# Altium schematic sheet mcu.SchDoc
size A3
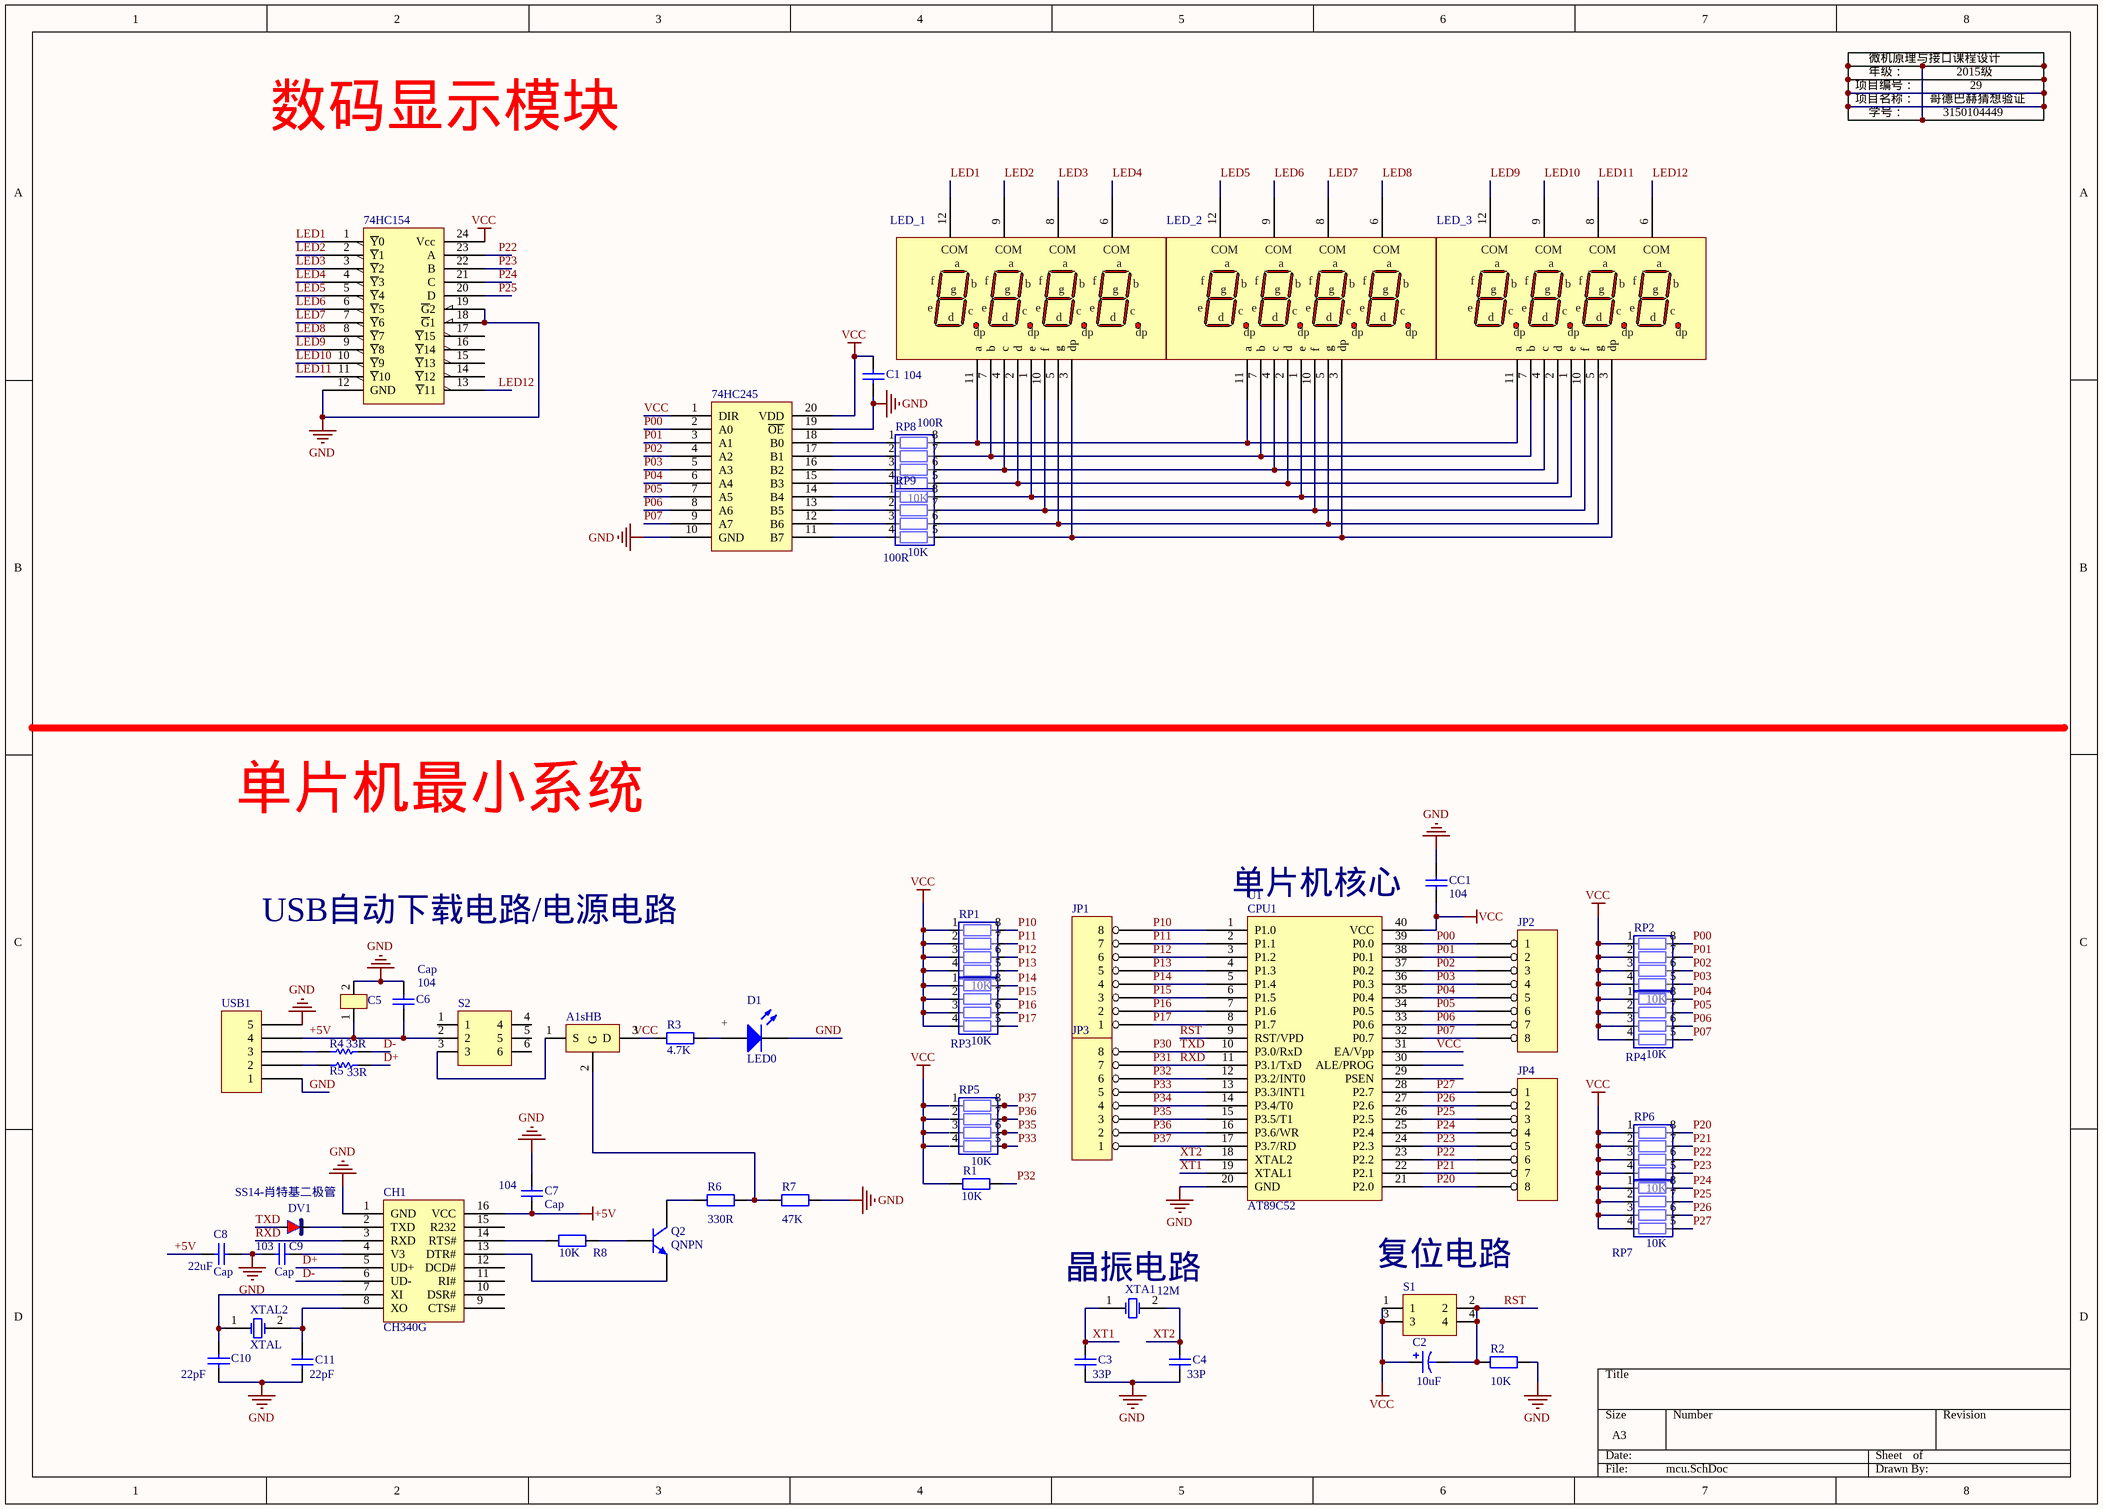
[diagram p0: mcu.SchDoc]

## Parts
74HC154  74HC154  [SOP24-74HC154D]  (value not drawn)
74HC245  74HC245  [SOP20-74HC245]  (value not drawn)
A1sHB  A1sHB  [A1sHB]  (value not drawn)
C1  value 104  [RAD-0.3]  (hidden comment: Cap)
C2  value 10uF  [RB7.6-15]  (hidden comment: Cap Pol1)
C3  value 33P  [RAD-0.3]  (hidden comment: Cap)
C4  value 33P  [RAD-0.3]  (hidden comment: Cap)
C5  470uF  [C5-CP1]  (value not drawn)
C6  Cap  value 104  [RAD-0.3]
C7  Cap  value 104  [RAD-0.3]
C8  Cap  value 22uF  [RAD-0.3]
C9  Cap  value 103  [RAD-0.3]
C10  value 22pF  [RAD-0.3]  (hidden comment: Cap)
C11  value 22pF  [RAD-0.3]  (hidden comment: Cap)
CC1  value 104  [RAD-0.3]  (hidden comment: Cap)
CH1  CH340G  [SOP16-CH1-CH340G]
D1  LED0  [LED-0]
DV1  SS14-肖特基二极管  [DV1-SS14]
JP1  JP1  [JP]  (value not drawn)
JP2  JP1  [JP]  (value not drawn)
JP3  JP1  [JP]  (value not drawn)
JP4  JP1  [JP]  (value not drawn)
LED_1  LED_12  [LED_12]  (value not drawn)
LED_2  LED_12  [LED_12]  (value not drawn)
LED_3  LED_12  [LED_12]  (value not drawn)
Q2  QNPN  [SOT-23B]
R1  value 10K  [AXIAL-0.4]  (hidden comment: Res2)
R2  value 10K  [AXIAL-0.4]  (hidden comment: Res2)
R3  value 4.7K  [AXIAL-0.4]  (hidden comment: Res2)
R4  33R  [AXIAL-0.3]
R5  33R  [AXIAL-0.3]
R6  value 330R  [AXIAL-0.4]  (hidden comment: Res2)
R7  value 47K  [AXIAL-0.4]  (hidden comment: Res2)
R8  value 10K  [AXIAL-0.4]  (hidden comment: Res2)
RP1  RP1  [RP-8P4R-0603]  (value not drawn)
RP2  RP1  [RP-8P4R-0603]  (value not drawn)
RP3  RP1  [RP-8P4R-0603]  (value not drawn)
RP4  RP1  [RP-8P4R-0603]  (value not drawn)
RP5  RP1  [RP-8P4R-0603]  (value not drawn)
RP6  RP1  [RP-8P4R-0603]  (value not drawn)
RP7  RP1  [RP-8P4R-0603]  (value not drawn)
RP8  RP1  [RP-8P4R-0603]  (value not drawn)
RP9  RP1  [RP-8P4R-0603]  (value not drawn)
S1  S1  [DIP4-S1]  (value not drawn)
S2  S2  [DIP6-S2]  (value not drawn)
U1  AT89C52  [CPU_DIP40]
USB1  USB1  [USB1]  (value not drawn)
XTA1  12M  [R38]
XTAL2  XTAL  [R38]

## Nets
+5V: C5.1 C6.1 C7.1 C8.1 CH1.16(VCC) S2.2 USB1.4
GND: 74HC154.12(GND) 74HC154.18(~{G}1) 74HC154.19(~{G}2) 74HC245.10(GND) 74HC245.19(~{OE}) C1.1 C3.1 C4.1 C5.2 C6.2 C7.2 C8.2 C9.1 C10.1 C11.1 CC1.2 CH1.1(GND) D1.2(K) R2.2 R7.2 U1.20(GND) USB1.1 USB1.5
VCC: 74HC154.24(Vcc) 74HC245.1(DIR) 74HC245.20(VDD) C1.2 C2.1 CC1.1 R1.1 RP1.1 RP1.2 RP1.3 RP1.4 RP2.1 RP2.2 RP2.3 RP2.4 RP3.1 RP3.2 RP3.3 RP3.4 RP4.1 RP4.2 RP4.3 RP4.4 RP6.1 RP6.2 RP6.3 RP6.4 RP7.1 RP7.2 RP7.3 RP7.4 S1.1 S1.3 U1.31(EA/Vpp) U1.40(VCC)
D+: CH1.5(UD+) R5.2
D-: CH1.6(UD-) R4.2
LED1: 74HC154.1(~{Y}0) LED_1.12(COM)
LED2: 74HC154.2(~{Y}1) LED_1.9(COM)
LED3: 74HC154.3(~{Y}2) LED_1.8(COM)
LED4: 74HC154.4(~{Y}3) LED_1.6(COM)
LED5: 74HC154.5(~{Y}4) LED_2.12(COM)
LED6: 74HC154.6(~{Y}5) LED_2.9(COM)
LED7: 74HC154.7(~{Y}6) LED_2.8(COM)
LED8: 74HC154.8(~{Y}7) LED_2.6(COM)
LED9: 74HC154.9(~{Y}8) LED_3.12(COM)
LED10: 74HC154.10(~{Y}9) LED_3.9(COM)
LED11: 74HC154.11(~{Y}10) LED_3.8(COM)
LED12: 74HC154.13(~{Y}11) LED_3.6(COM)
P00: 74HC245.2(A0) JP2.1 RP2.8 U1.39(P0.0)
P01: 74HC245.3(A1) JP2.2 RP2.7 U1.38(P0.1)
P02: 74HC245.4(A2) JP2.3 RP2.6 U1.37(P0.2)
P03: 74HC245.5(A3) JP2.4 RP2.5 U1.36(P0.3)
P04: 74HC245.6(A4) JP2.5 RP4.8 U1.35(P0.4)
P05: 74HC245.7(A5) JP2.6 RP4.7 U1.34(P0.5)
P06: 74HC245.8(A6) JP2.7 RP4.6 U1.33(P0.6)
P07: 74HC245.9(A7) JP2.8 RP4.5 U1.32(P0.7)
P10: JP1.8 RP1.8 U1.1(P1.0)
P11: JP1.7 RP1.7 U1.2(P1.1)
P12: JP1.6 RP1.6 U1.3(P1.2)
P13: JP1.5 RP1.5 U1.4(P1.3)
P14: JP1.4 RP3.8 U1.5(P1.4)
P15: JP1.3 RP3.7 U1.6(P1.5)
P16: JP1.2 RP3.6 U1.7(P1.6)
P17: JP1.1 RP3.5 U1.8(P1.7)
P20: JP4.8 RP6.8 U1.21(P2.0)
P21: JP4.7 RP6.7 U1.22(P2.1)
P22: 74HC154.23(A) JP4.6 RP6.6 U1.23(P2.2)
P23: 74HC154.22(B) JP4.5 RP6.5 U1.24(P2.3)
P24: 74HC154.21(C) JP4.4 RP7.8 U1.25(P2.4)
P25: 74HC154.20(D) JP4.3 RP7.7 U1.26(P2.5)
P26: JP4.2 RP7.6 U1.27(P2.6)
P27: JP4.1 RP7.5 U1.28(P2.7)
P30: DV1.1 JP3.8 U1.10(P3.0/RxD)  [also labelled TXD]
P31: CH1.3(RXD) JP3.7 U1.11(P3.1/TxD)  [also labelled RXD]
P32: JP3.6 R1.2 U1.12(P3.2/INT0)
P33: JP3.5 RP5.5 U1.13(P3.3/INT1)
P34: JP3.4 U1.14(P3.4/T0)
P35: JP3.3 RP5.6 U1.15(P3.5/T1)
P36: JP3.2 RP5.7 U1.16(P3.6/WR)
P37: JP3.1 RP5.8 U1.17(P3.7/RD)
RST: C2.2 R2.1 S1.2 S1.4 U1.9(RST/VPD)
XT1: C3.2 U1.19(XTAL1) XTA1.1(OSC1)
XT2: C4.2 U1.18(XTAL2) XTA1.2(OSC2)
Net74HC245_11: 74HC245.11(B7) RP9.4
Net74HC245_12: 74HC245.12(B6) RP9.3
Net74HC245_13: 74HC245.13(B5) RP9.2
Net74HC245_14: 74HC245.14(B4) RP9.1
Net74HC245_15: 74HC245.15(B3) RP8.4
Net74HC245_16: 74HC245.16(B2) RP8.3
Net74HC245_17: 74HC245.17(B1) RP8.2
Net74HC245_18: 74HC245.18(B0) RP8.1
NetA1sHB_1: A1sHB.1(S) S2.3
NetA1sHB_2: A1sHB.2(G) R6.2 R7.1
NetA1sHB_3: A1sHB.3(D) R3.1
NetC9_2: C9.2 CH1.4(V3)
NetC10_2: C10.2 CH1.7(XI) XTAL2.1(OSC1)
NetC11_2: C11.2 CH1.8(XO) XTAL2.2(OSC2)
NetCH1_2: CH1.2(TXD) DV1.2
NetCH1_13: CH1.13(DTR#) Q2.3(E)
NetCH1_14: CH1.14(RTS#) R8.1
NetD1_1: D1.1(A) R3.2
NetLED_1_1: LED_1.1(e) LED_2.1(e) LED_3.1(e) RP9.8
NetLED_1_2: LED_1.2(d) LED_2.2(d) LED_3.2(d) RP8.5
NetLED_1_3: LED_1.3(dp) LED_2.3(dp) LED_3.3(dp) RP9.5
NetLED_1_4: LED_1.4(c) LED_2.4(c) LED_3.4(c) RP8.6
NetLED_1_5: LED_1.5(g) LED_2.5(g) LED_3.5(g) RP9.6
NetLED_1_7: LED_1.7(b) LED_2.7(b) LED_3.7(b) RP8.7
NetLED_1_10: LED_1.10(f) LED_2.10(f) LED_3.10(f) RP9.7
NetLED_1_11: LED_1.11(a) LED_2.11(a) LED_3.11(a) RP8.8
NetQ2_1: Q2.1(C) R6.1
NetQ2_2: Q2.2(B) R8.2
NetR4_1: R4.1 USB1.3
NetR5_1: R5.1 USB1.2

Not connected (* = marked no-connect by the designer): 74HC154 14(~{Y}12) 15(~{Y}13) 16(~{Y}14) 17(~{Y}15); CH1 9(CTS#) 10(DSR#) 11(RI#) 12(DCD#) 15(R232); RP5 1 2 3 4; S2 1 4 5 6; U1 29(PSEN) 30(ALE/PROG)

## Notes on the sheet
- 项目编号：
- 项目名称：
- 微机原理与接口课程设计
- 年级：
- 哥德巴赫猜想验证
- 2015级
- 29
- 数码显示模块
- 学号：
- 3150104449
- (near RP8) 100R
- (near RP9) 100R
- 单片机最小系统
- (near U1) 单片机核心
- USB自动下载电路/电源电路
- +
- (near XTA1) 晶振电路
- 复位电路
- Labels drawn without touching a wire or pin: VCC
- (in symbol AT89C52) CPU1
- (in symbol RP1) 10K

## Library data of the parts
C1 C3 C4 C6-C11 CC1 = Cap: Capacitor; Published: 8-Jun-2000; LatestRevisionDate: 17-Jul-2002; LatestRevisionNote: Re-released for DXP Platform.; PackageReference: RAD-0.3; Publisher: Altium Limited
C2 = Cap Pol1: Polarized Capacitor (Radial); Published: 8-Jun-2000; LatestRevisionDate: 17-Jul-2002; LatestRevisionNote: Re-released for DXP Platform.; PackageReference: RB7.6-15; Publisher: Altium Limited
C5 = C5: High Conductance Fast Diode; Published: 8-Jun-2000; LatestRevisionDate: 17-Jul-2002; LatestRevisionNote: Re-released for DXP Platform.; DatasheetDocument: 1997; PackageReference: DO-35; Publisher: Altium Limited; Code_JEDEC: DO-204-AH; ComponentLink1Description: Manufacturer Link; ComponentLink1URL: http://www.fairchildsemi.com/; ComponentLink2Description: Datasheet; ComponentLink2URL: http://www.fairchildsemi.com/ds/1N%2F1N4448.pdf
CH1 = CH1: Published: 8-Jun-2000; LatestRevisionDate: 17-Jul-2002; LatestRevisionNote: Re-released for DXP Platform.; DatasheetDocument: 1997; PackageReference: DO-35; Publisher: Altium Limited; Code_JEDEC: DO-204-AH; ComponentLink1Description: Manufacturer Link; ComponentLink1URL: http://www.fairchildsemi.com/; ComponentLink2Description: Datasheet; ComponentLink2URL: http://www.fairchildsemi.com/ds/1N%2F1N4448.pdf
D1 = LED0: Typical INFRARED GaAs LED; Published: 8-Jun-2000; LatestRevisionDate: 08-Jul-2005; LatestRevisionNote: Mech Layer 1 removed.; PackageReference: LED-0; Publisher: Altium Limited
DV1 = DV1: Published: 8-Jun-2000; LatestRevisionDate: 17-Jul-2002; LatestRevisionNote: Re-released for DXP Platform.; DatasheetDocument: 1997; PackageReference: DO-35; Publisher: Altium Limited; Code_JEDEC: DO-204-AH; ComponentLink1Description: Manufacturer Link; ComponentLink1URL: http://www.fairchildsemi.com/; ComponentLink2Description: Datasheet; ComponentLink2URL: http://www.fairchildsemi.com/ds/1N%2F1N4448.pdf
Q2 = QNPN: NPN Bipolar Transistor; Published: 8-Jun-2000; LatestRevisionDate: 17-Jul-2002; LatestRevisionNote: Re-released for DXP Platform.; PackageReference: SOT-23B; Publisher: Altium Limited; Code_JEDEC: SOT-23
R1-R3 R6-R8 = Res2: Resistor; Published: 8-Jun-2000; LatestRevisionDate: 17-Jul-2002; LatestRevisionNote: Re-released for DXP Platform.; PackageReference: AXIAL-0.4; Publisher: Altium Limited
R4 = Res1: Resistor; Published: 8-Jun-2000; LatestRevisionDate: 17-Jul-2002; LatestRevisionNote: Re-released for DXP Platform.; PackageReference: AXIAL-0.3; Publisher: Altium Limited; Value: 33R
R5 = Res1: Resistor; Value: 1K; Published: 8-Jun-2000; LatestRevisionDate: 17-Jul-2002; LatestRevisionNote: Re-released for DXP Platform.; PackageReference: AXIAL-0.3; Publisher: Altium Limited
XTA1 XTAL2 = XTAL: Crystal Oscillator; Published: 8-Jun-2000; LatestRevisionDate: 17-Jul-2002; LatestRevisionNote: Re-released for DXP Platform.; PackageReference: R38; Publisher: Altium Limited
74HC154 = 74HC154: Published: 8-Jun-2000; LatestRevisionDate: 17-Jul-2002; LatestRevisionNote: Re-released for DXP Platform.; DatasheetDocument: 1997; PackageReference: DO-35; Publisher: Altium Limited; Code_JEDEC: DO-204-AH; ComponentLink1Description: Manufacturer Link; ComponentLink1URL: http://www.fairchildsemi.com/; ComponentLink2Description: Datasheet; ComponentLink2URL: http://www.fairchildsemi.com/ds/1N%2F1N4448.pdf
74HC245 = 74HC245: Published: 8-Jun-2000; LatestRevisionDate: 17-Jul-2002; LatestRevisionNote: Re-released for DXP Platform.; DatasheetDocument: 1997; PackageReference: DO-35; Publisher: Altium Limited; Code_JEDEC: DO-204-AH; ComponentLink1Description: Manufacturer Link; ComponentLink1URL: http://www.fairchildsemi.com/; ComponentLink2Description: Datasheet; ComponentLink2URL: http://www.fairchildsemi.com/ds/1N%2F1N4448.pdf
A1sHB = A1sHB: Published: 8-Jun-2000; LatestRevisionDate: 17-Jul-2002; LatestRevisionNote: Re-released for DXP Platform.; DatasheetDocument: 1997; PackageReference: DO-35; Publisher: Altium Limited; Code_JEDEC: DO-204-AH; ComponentLink1Description: Manufacturer Link; ComponentLink1URL: http://www.fairchildsemi.com/; ComponentLink2Description: Datasheet; ComponentLink2URL: http://www.fairchildsemi.com/ds/1N%2F1N4448.pdf
JP1-JP4 = JP1: Published: 8-Jun-2000; LatestRevisionDate: 17-Jul-2002; LatestRevisionNote: Re-released for DXP Platform.; DatasheetDocument: 1997; PackageReference: DO-35; Publisher: Altium Limited; Code_JEDEC: DO-204-AH; ComponentLink1Description: Manufacturer Link; ComponentLink1URL: http://www.fairchildsemi.com/; ComponentLink2Description: Datasheet; ComponentLink2URL: http://www.fairchildsemi.com/ds/1N%2F1N4448.pdf
LED_1-LED_3 = LED_12: Published: 8-Jun-2000; LatestRevisionDate: 17-Jul-2002; LatestRevisionNote: Re-released for DXP Platform.; DatasheetDocument: 1997; PackageReference: DO-35; Publisher: Altium Limited; Code_JEDEC: DO-204-AH; ComponentLink1Description: Manufacturer Link; ComponentLink1URL: http://www.fairchildsemi.com/; ComponentLink2Description: Datasheet; ComponentLink2URL: http://www.fairchildsemi.com/ds/1N%2F1N4448.pdf
RP1-RP9 = RP1: Published: 8-Jun-2000; LatestRevisionDate: 17-Jul-2002; LatestRevisionNote: Re-released for DXP Platform.; DatasheetDocument: 1997; PackageReference: DO-35; Publisher: Altium Limited; Code_JEDEC: DO-204-AH; ComponentLink1Description: Manufacturer Link; ComponentLink1URL: http://www.fairchildsemi.com/; ComponentLink2Description: Datasheet; ComponentLink2URL: http://www.fairchildsemi.com/ds/1N%2F1N4448.pdf
S1 = S1: Published: 8-Jun-2000; LatestRevisionDate: 17-Jul-2002; LatestRevisionNote: Re-released for DXP Platform.; DatasheetDocument: 1997; PackageReference: DO-35; Publisher: Altium Limited; Code_JEDEC: DO-204-AH; ComponentLink1Description: Manufacturer Link; ComponentLink1URL: http://www.fairchildsemi.com/; ComponentLink2Description: Datasheet; ComponentLink2URL: http://www.fairchildsemi.com/ds/1N%2F1N4448.pdf
S2 = S2: Published: 8-Jun-2000; LatestRevisionDate: 17-Jul-2002; LatestRevisionNote: Re-released for DXP Platform.; DatasheetDocument: 1997; PackageReference: DO-35; Publisher: Altium Limited; Code_JEDEC: DO-204-AH; ComponentLink1Description: Manufacturer Link; ComponentLink1URL: http://www.fairchildsemi.com/; ComponentLink2Description: Datasheet; ComponentLink2URL: http://www.fairchildsemi.com/ds/1N%2F1N4448.pdf
U1 = AT89C52: Published: 8-Jun-2000; LatestRevisionDate: 17-Jul-2002; LatestRevisionNote: Re-released for DXP Platform.; DatasheetDocument: 1997; PackageReference: DO-35; Publisher: Altium Limited; Code_JEDEC: DO-204-AH; ComponentLink1Description: Manufacturer Link; ComponentLink1URL: http://www.fairchildsemi.com/; ComponentLink2Description: Datasheet; ComponentLink2URL: http://www.fairchildsemi.com/ds/1N%2F1N4448.pdf
USB1 = USB1: Published: 8-Jun-2000; LatestRevisionDate: 17-Jul-2002; LatestRevisionNote: Re-released for DXP Platform.; DatasheetDocument: 1997; PackageReference: DO-35; Publisher: Altium Limited; Code_JEDEC: DO-204-AH; ComponentLink1Description: Manufacturer Link; ComponentLink1URL: http://www.fairchildsemi.com/; ComponentLink2Description: Datasheet; ComponentLink2URL: http://www.fairchildsemi.com/ds/1N%2F1N4448.pdf